# EAGLE design shield (EAGLE 7.2.0)
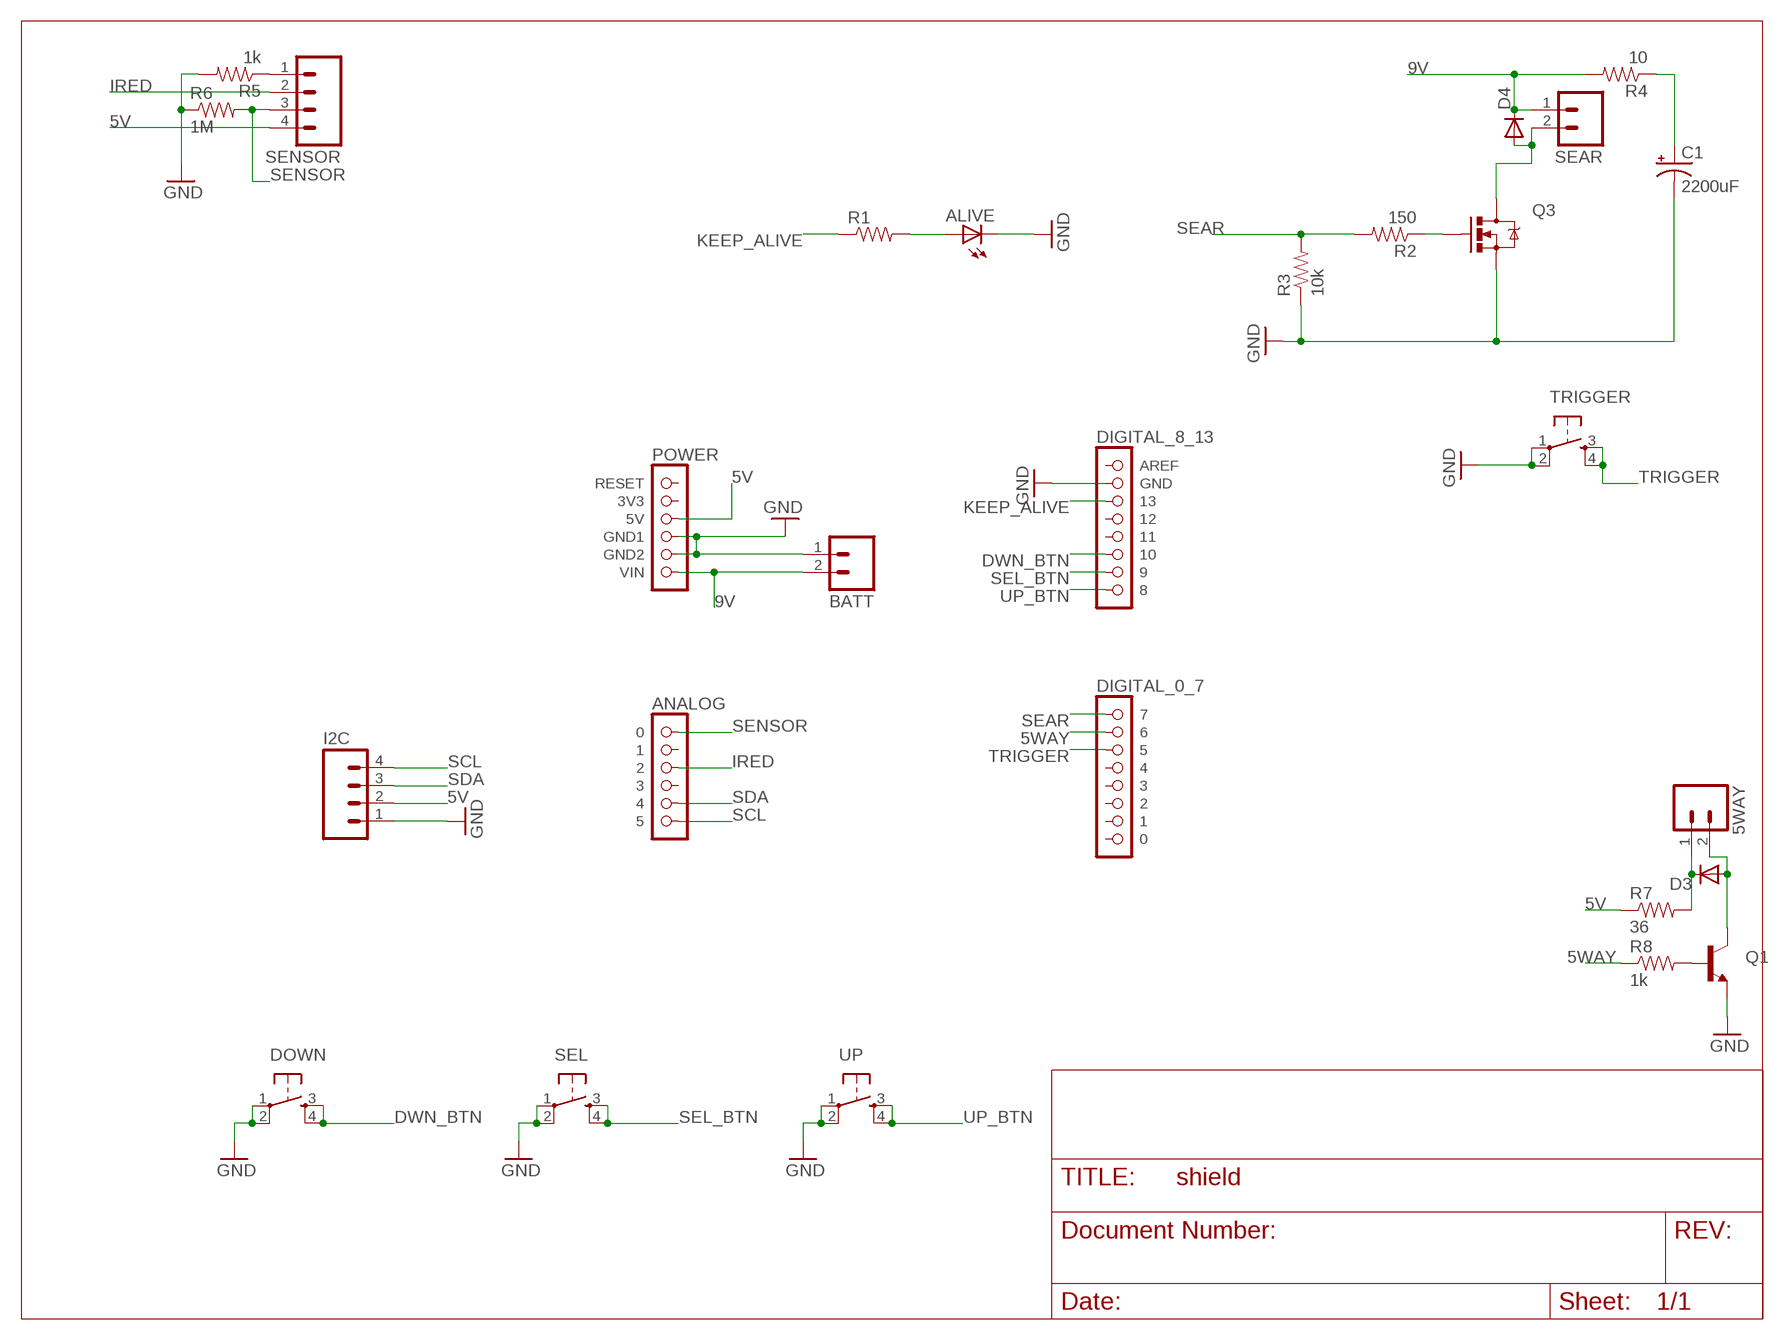
[diagram p0: schematic, sheet 1]

## Parts
5WAY  M02PTH  [1X02]
ALIVE  LED3MM  [LED3MM]
BATT  M02PTH  [1X02]
C1  2200uF  CAP_POLPTH4  [CPOL-RADIAL-1000UF-25V]
D3  DIODEPTH  [DIODE-1N4001]
D4  DIODEPTH  [DIODE-1N4001]
DOWN  TAC_SWITCHPTH  [TACTILE-PTH]
I2C  M04PTH  [1X04]
Q1  TRANSISTOR_NPNTO-92-AMMO  [TO-92-AMMO]
Q3  MOSFET-NCHANNELPTH2  [TO220V]
R1  RESISTORPTH-1/4W  [AXIAL-0.4]
R2  150  RESISTORPTH-1/4W  [AXIAL-0.4]
R3  10k  RESISTORPTH-1/4W  [AXIAL-0.4]
R4  10  RESISTORPTH-1/4W  [AXIAL-0.4]
R5  1k  RESISTORPTH-1/4W  [AXIAL-0.4]
R6  1M  RESISTORPTH-1/4W  [AXIAL-0.4]
R7  36  RESISTORPTH-1/4W  [AXIAL-0.4]
R8  1k  RESISTORPTH-1/4W  [AXIAL-0.4]
SEAR  M02PTH  [1X02]
SEL  TAC_SWITCHPTH  [TACTILE-PTH]
SENSOR  M04PTH  [1X04]
TRIGGER  TAC_SWITCHPTH  [TACTILE-PTH]
U$1  POWER  [1X06]
U$2  ANALOG  [1X06]
U$3  DIGITAL_0_7  [1X08]
U$4  DIGITAL_8_13  [1X08]
UP  TAC_SWITCHPTH  [TACTILE-PTH]

## Nets
5V: I2C.2 R7.P$1 SENSOR.4 U$1.3(5V)
5WAY: R8.P$1 U$3.2
9V: BATT.2 D4.C R4.P$2 SEAR.1 U$1.6(VIN)
DWN_BTN: DOWN.3 DOWN.4 U$4.6
GND: ALIVE.K(C) BATT.1 C1.2(-) DOWN.1 DOWN.2 I2C.1 Q1.1(E) Q3.3(S) R3.P$1 R5.P$2 R6.P$1 SEL.1 SEL.2 TRIGGER.1 TRIGGER.2 U$1.4(GND1) U$1.5(GND2) U$4.2(GND) UP.1 UP.2
IRED: SENSOR.2 U$2.3
KEEP_ALIVE: R1.P$1 U$4.3
N$1: Q1.2(B) R8.P$2
N$2: ALIVE.A R1.P$2
N$3: Q3.1(G) R2.P$1
N$4: C1.1(+) R4.P$1
N$5: 5WAY.1 D3.C R7.P$2
N$6: R5.P$1 SENSOR.1
N$7: D4.A Q3.2(D) SEAR.2
N$15: 5WAY.2 D3.A Q1.3(C)
SCL: I2C.4 U$2.6
SDA: I2C.3 U$2.5
SEAR: R2.P$2 R3.P$2 U$3.1
SEL_BTN: SEL.3 SEL.4 U$4.7
SENSOR: R6.P$2 SENSOR.3 U$2.1
TRIGGER: TRIGGER.3 TRIGGER.4 U$3.3
UP_BTN: U$4.8 UP.3 UP.4
Unconnected: U$1.1(RESET) U$1.2(3V3) U$2.2 U$2.4 U$3.4 U$3.5 U$3.6 U$3.7 U$3.8 U$4.1(AREF) U$4.4 U$4.5

## Library data of the parts
5WAY BATT SEAR = SparkFun:M02: Header 2 Standard 2-pin 0.1" header. Use with straight break away headers (SKU : PRT-00116), right angle break away headers (PRT-00553), swiss pins (PRT-00743), machine pins (PRT-00117), and female headers (PRT-00115). Molex polarized connector foot print use with SKU : PRT-08233 with associated crimp pins and housings.
ALIVE = SparkFun:LED: LEDs Standard schematic elements and footprints for 5mm, 3mm, 1206, and 0603 sized LEDs. 5mm - Spark Fun Electronics SKU : COM-00529 (and others)
C1 = SparkFun:CAP_POL: Capacitor Polarized These are standard SMD and PTH capacitors. Normally 10uF, 47uF, and 100uF in electrolytic and tantalum varieties. Always verify the external diameter of the through hole cap, it varies with capacity, voltage, and manufacturer. The EIA devices should be standard.
D3 D4 = SparkFun:DIODE: Diode These are standard reverse protection diodes and small signal diodes. SMA package can handle up to about 1A. SOD-323 can handle about 200mA. What the SOD-323 package when ordering, there are some mfgs out there that are 5-pin packages.
DOWN SEL TRIGGER UP = SparkFun:TAC_SWITCH: Momentary Switch Button commonly used for reset or general input. Spark Fun Electronics SKU : COM-00097
I2C SENSOR = SparkFun:M04: Header 4 Standard 4-pin 0.1" header. Use with straight break away headers (SKU : PRT-00116), right angle break away headers (PRT-00553), swiss pins (PRT-00743), machine pins (PRT-00117), and female headers (PRT-00115). Molex polarized connector foot print use with SKU : PRT-08231 with associated crimp pins and housings. 1MM SMD Version SKU: PRT-10208
Q1 = SparkFun:TRANSISTOR_NPN: Transistor NPN BJT configuration in SOT23 package. MMBT2222 is the common NPN we use. Double check BCE configuration again layout.
Q3 = SparkFun:MOSFET-NCHANNEL
R1-R8 = SparkFun:RESISTOR: Resistor Basic schematic elements and footprints for 0603, 1206, and PTH resistors.
U$1 = arduino:POWER
U$2 = arduino:ANALOG
U$3 = arduino:DIGITAL_0_7
U$4 = arduino:DIGITAL_8_13

## Board
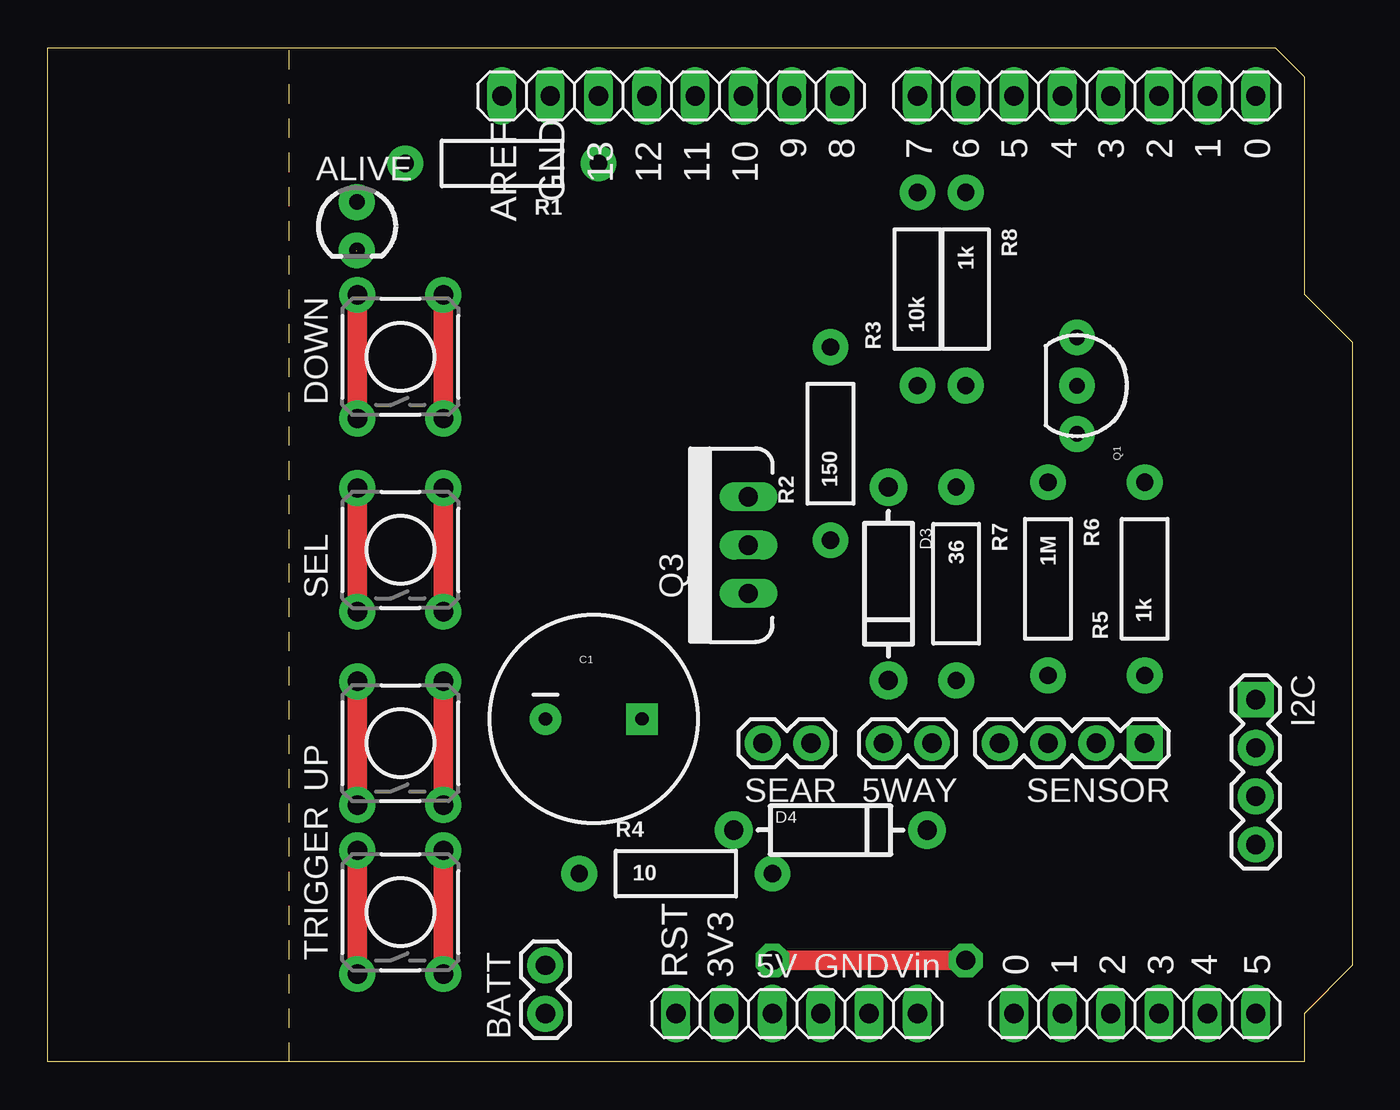
[diagram p1: board, top side]
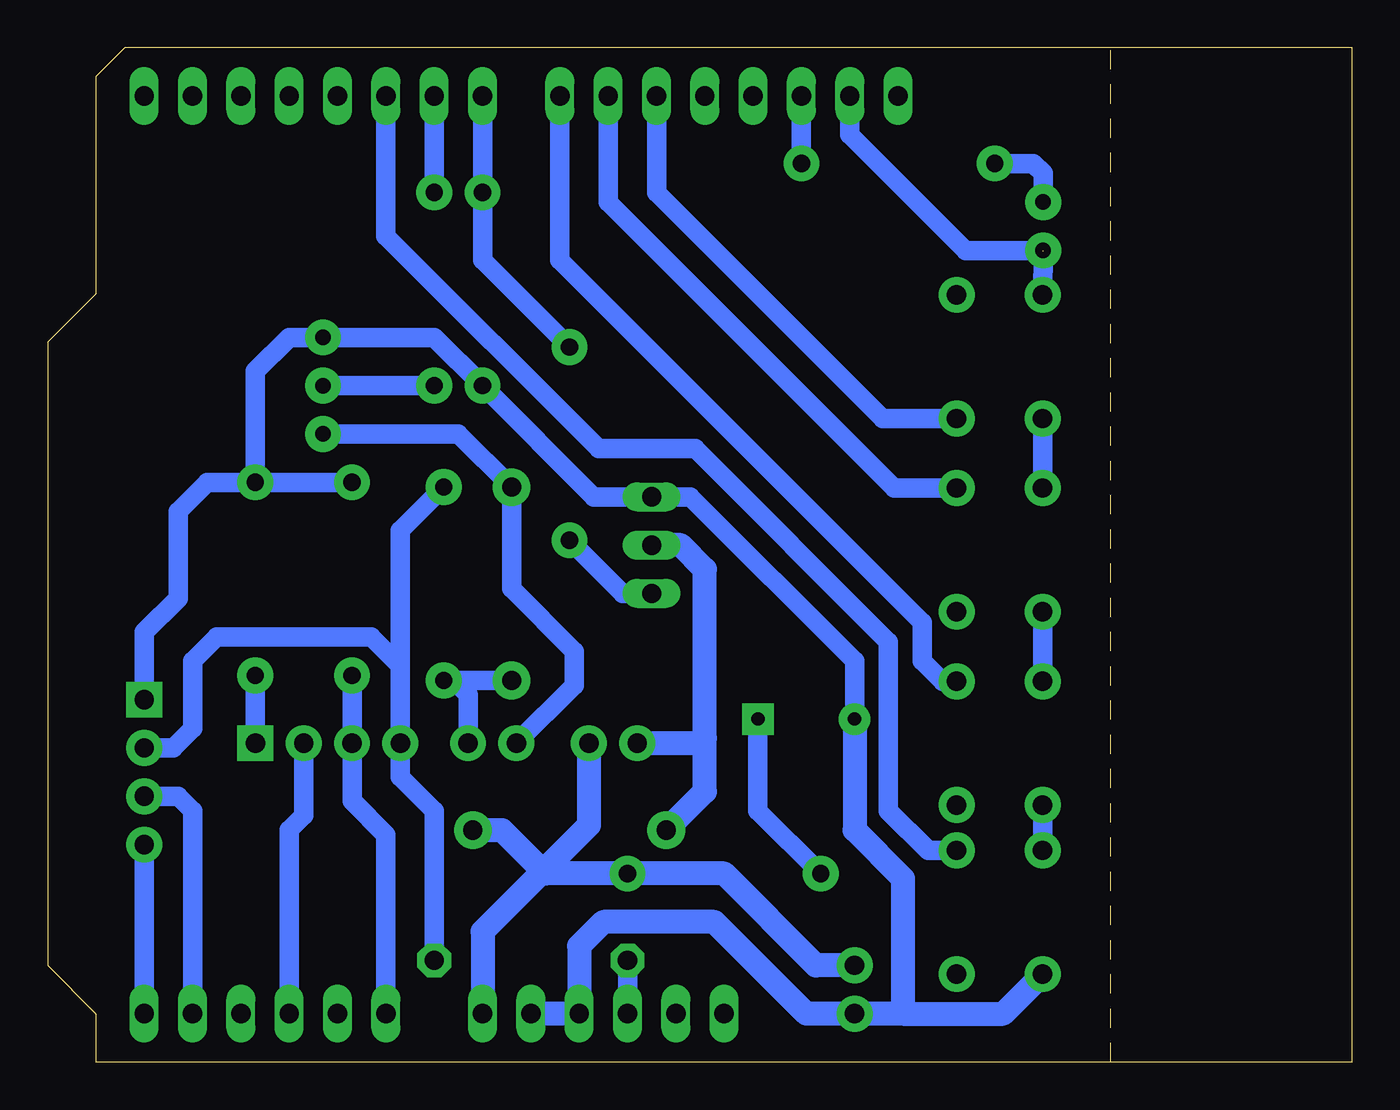
[diagram p2: board, bottom side, seen from below]

Size 68.58 x 53.34 mm. Coordinates in mm from the lower left corner, seen from the top.
Outline: 12.7,53.34 0,53.34 0,0 12.7,0
Outline: 12.7,53.34 64.52,53.34 66.04,51.82 66.04,40.39 68.58,37.85 68.58,5.08 66.04,2.54 66.04,0 12.7,0
Outline: 12.7,0 12.7,53.34
Copper layers (1*16): Top 0.035mm / dielectric 1.5mm / Bottom 0.035mm
Design rules "default": minimum track width 0.8mm, minimum drill 0.6mm, track to track 8mil, track to pad 8mil, pad to pad 8mil, via to via 8mil, smd to smd 8mil, copper to edge 40mil, drill to drill 8mil, minimum pad ring 10mil, minimum via ring 8mil, stop-mask expansion 4mil, vias tented up to drill 0mil, thermal gap 10mil

### Footprints (pad centres in the part's own frame; a part is rotated, then mirrored left to right if it is on the bottom)
1X02 = drill 1.016 pad 1.88: 1 0,0; 2 2.54,0
LED3MM = drill 0.813 pad 1.88: A -1.27,0; K 1.27,0
CPOL-RADIAL-1000UF-25V = drill 0.7 pad 1.651 square: 1 2.54,0 | drill 0.7 pad 1.651: 2 -2.54,0
DIODE-1N4001 = drill 1 pad 1.981: A -5.08,0; C 5.08,0
TACTILE-PTH = drill 1.016 pad 1.88: 1 -3.251,2.261; 2 3.251,2.261; 3 -3.251,-2.261; 4 3.251,-2.261
1X04 = drill 1.016 pad 1.88 square: 1 0,0 | drill 1.016 pad 1.88: 2 2.54,0; 3 5.08,0; 4 7.62,0
TO-92-AMMO = drill 0.813 pad 1.88: 1 -2.54,0; 2 0,0; 3 2.54,0
TO220V = drill 1.016 long: 1 -2.54,0; 2 0,0; 3 2.54,0
AXIAL-0.4 = drill 0.9 pad 1.88: P$1 -5.08,0; P$2 5.08,0
1X06 = drill 1.016 long: 1 -6.35,0; 2 -3.81,0; 3 -1.27,0; 4 1.27,0; 5 3.81,0; 6 6.35,0
1X08 = drill 1.016 long: 1 -8.89,0; 2 -6.35,0; 3 -3.81,0; 4 -1.27,0; 5 1.27,0; 6 3.81,0; 7 6.35,0; 8 8.89,0

### Placement (x,y rotation side)
5WAY  46.48,16.76 180 top
ALIVE  16.26,43.94 270 top
BATT  26.16,2.54 90 top
C1  28.7,18.03 0 top
D3  44.2,25.15 270 top
D4  41.15,12.19 0 top
DOWN  18.54,37.08 90 top
I2C  63.5,19.05 270 top
Q1  54.1,35.56 270 top
Q3  36.83,27.18 90 top
R1  23.88,47.24 180 top
R2  41.15,32.51 90 top
R3  45.72,40.64 90 top
R4  33.02,9.91 0 top
R5  57.66,25.4 90 top
R6  52.58,25.4 270 top
R7  47.75,25.15 270 top
R8  48.26,40.64 270 top
SEAR  40.13,16.76 180 top
SEL  18.54,26.92 90 top
SENSOR  57.66,16.76 180 top
TRIGGER  18.54,7.87 90 top
U$1  39.37,2.54 0 top
U$2  57.15,2.54 0 top
U$3  54.61,50.8 0 top
U$4  32.77,50.8 0 top
UP  18.54,16.76 90 top

### Tracks (layer width: path | path; a pad name or v marks a point on that pad's centre or on a via)
5V  (via drill 1 pad 1.78)
  Top 1.016: v38.1,5.33 v48.26,5.33
  Bottom 1.016: U$1.3 v38.1,5.33 | v48.26,5.33 48.26,13.21 50.04,14.99 SENSOR.4 50.04,20.83 | I2C.2 61.98,16.51 60.96,17.53 60.96,21.08 59.69,22.35 51.56,22.35 50.04,20.83 | 50.04,20.83 50.04,27.94 R7.P$1
5WAY
  Bottom 1.016: U$3.2 R8.P$1
9V
  Bottom 1.27: 42.42,9.91 R4.P$2 33.02,9.91 28.19,5.08 BATT.2 | 42.42,9.91 42.67,9.91 | 42.67,9.91 45.72,6.86 U$1.6 | D4.C 44.7,12.19 42.42,9.91 | SEAR.1 40.13,12.45 42.67,9.91
DWN_BTN
  Top 1.016: DOWN.3 DOWN.4
  Bottom 1.016: U$4.6 36.58,45.72 24.69,33.83 DOWN.3
GND  (1 unrouted)
  Top 1.016: TRIGGER.1 TRIGGER.2 | UP.1 UP.2 | SEL.1 SEL.2 | DOWN.1 DOWN.2
  Bottom 1.016: DOWN.1 SEL.2 | UP.2 SEL.1 | 42.93,2.79 U$1.5 | TRIGGER.2 UP.1 | 16.26,42.65 DOWN.2 | U$4.2 26.42,48.77 20.32,42.67 ALIVE.K | R5.P$2 57.66,36.32 55.88,38.1 Q1.1 48.26,38.1 R3.P$1 39.88,29.72 Q3.3 34.8,29.72 26.16,21.08 C1.2 | R5.P$2 R6.P$1 | R5.P$2 60.2,30.48 61.72,28.96 61.72,24.38 63.5,22.61 I2C.1
  Bottom 1.27: U$1.5 U$1.4 40.64,6.1 39.37,7.37 33.53,7.37 28.7,2.54 BATT.1 23.62,2.54 | C1.2 26.16,12.19 23.62,9.65 23.62,2.54 | 23.62,2.54 18.36,2.54 TRIGGER.1
IRED
  Bottom 1.016: U$2.3 55.88,12.19 55.12,12.95 SENSOR.2
KEEP_ALIVE
  Bottom 1.016: U$4.3 R1.P$1
N$1
  Bottom 1.016: R8.P$2 Q1.2
N$2
  Bottom 1.016: R1.P$2 16.76,47.24 16.26,46.74 ALIVE.A
N$3
  Bottom 1.016: Q3.1 38.35,24.64 R2.P$1
N$4
  Bottom 1.016: C1.1 31.24,13.21 R4.P$1
N$5
  Bottom 1.016: D3.C 47.24,20.07 | 47.24,20.07 R7.P$2 | 5WAY.1 46.48,19.3 47.24,20.07
N$6
  Bottom 1.016: SENSOR.1 R5.P$1
N$7
  Bottom 1.27: D4.A 34.04,14.22 34.04,17.02 | 34.04,17.02 34.04,25.91 35.31,27.18 Q3.2 | SEAR.2 34.29,16.76 34.04,17.02
N$15
  Bottom 1.016: Q1.3 46.99,33.02 D3.A 44.2,24.89 40.89,21.59 40.89,19.81 5WAY.2
SCL
  Bottom 1.016: I2C.4 U$2.6
SDA
  Bottom 1.016: U$2.5 60.96,10.41 60.96,10.92 60.96,13.21 61.72,13.97 I2C.3
SEAR
  Bottom 1.016: U$3.1 R3.P$2 45.72,42.16 R2.P$2
SEL_BTN
  Top 1.016: SEL.3 SEL.4
  Bottom 1.016: U$4.7 39.12,45.21 24.08,30.18 SEL.4
SENSOR
  Bottom 1.016: U$2.1 50.8,11.94 52.58,13.72 SENSOR.3 R6.P$2
TRIGGER
  Top 1.016: TRIGGER.4 TRIGGER.3
  Bottom 1.016: U$3.3 50.8,43.43 39.62,32.26 34.54,32.26 24.38,22.1 24.38,13.21 22.3,11.12 TRIGGER.4
UP_BTN
  Top 1.016: UP.3 UP.4
  Bottom 1.016: U$4.8 41.66,42.16 22.61,23.11 22.61,21.08 21.54,20.02 UP.4

### Text on the board
tNames: 9 | 8 | 7 | 6 | 5 | 4 | 3 | 2 | 1 | 0 | 13 | 12 | 11 | 10 | GND | AREF | 0 | 1 | 2 | 3 | 4 | 5 | RST | 3V3 | 5V | GND | Vin
TallParts: USB | ISP | PWR
ArduinoHoles: 3.2mm | 2.2mm | 3.2mm